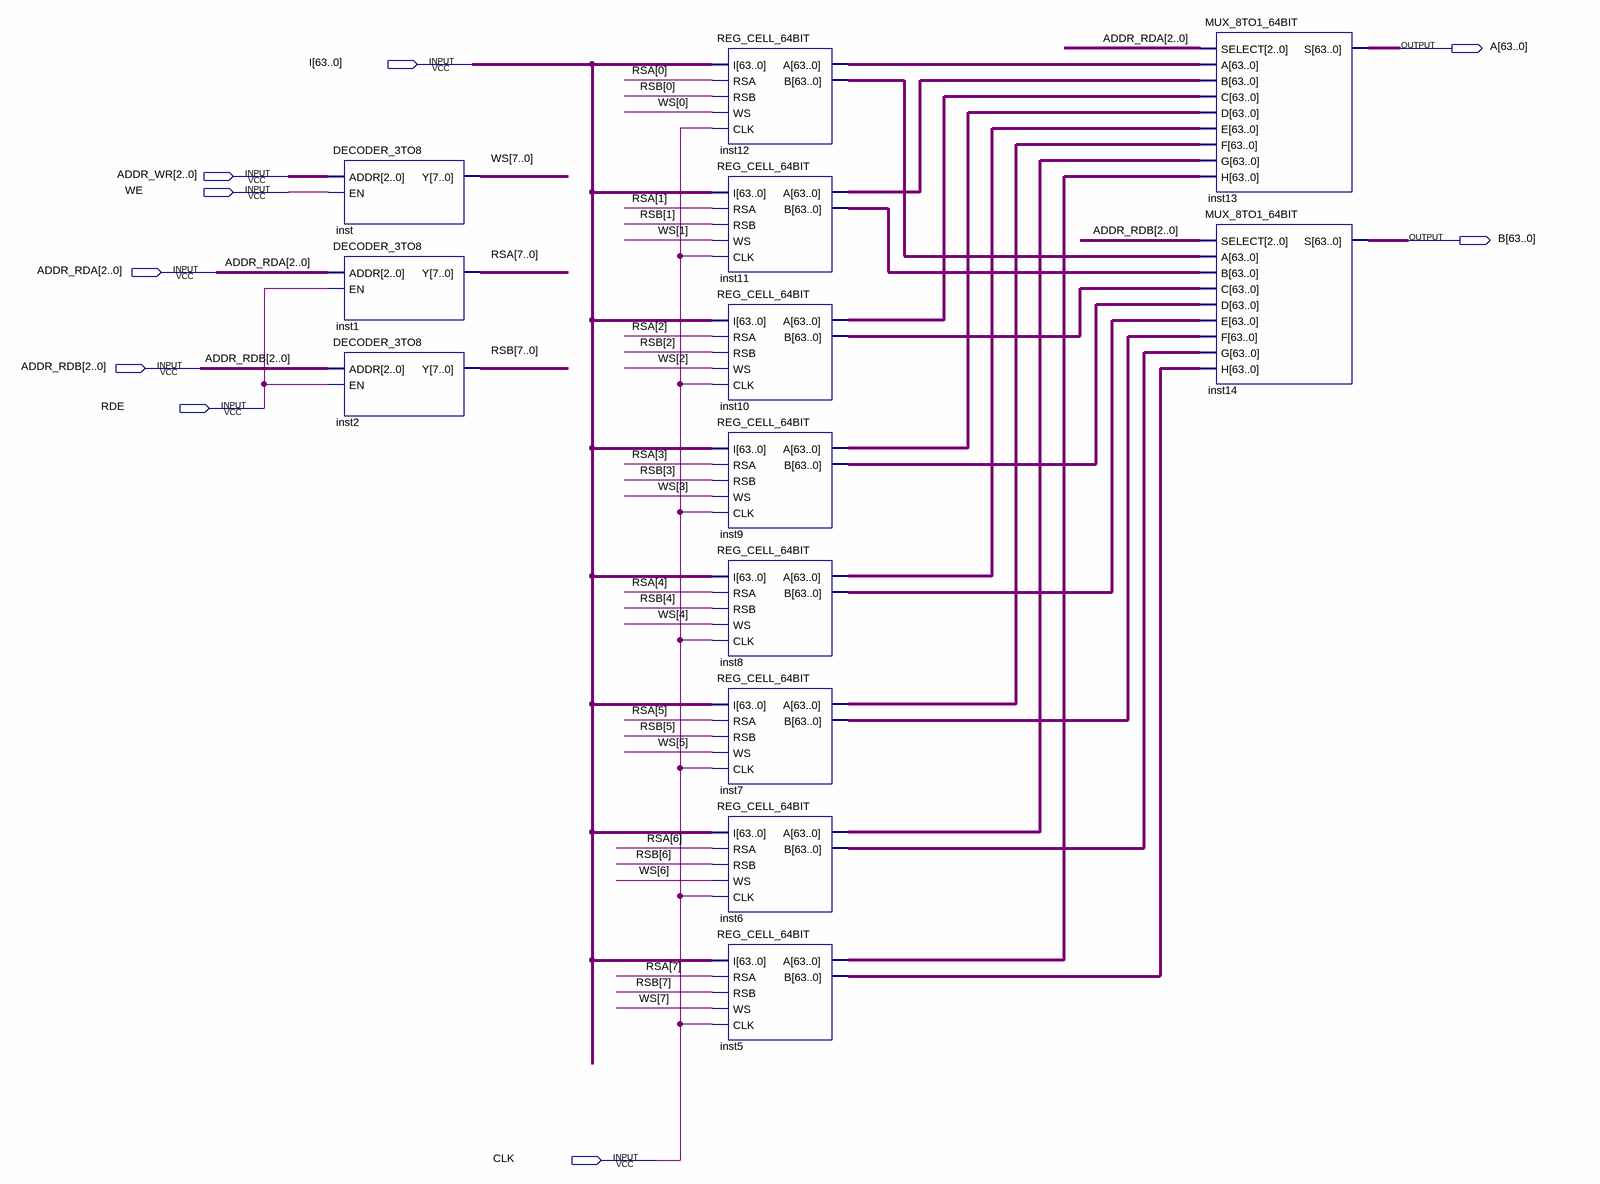
[diagram p0: schematic sheet]
// Quartus schematic REG_FILE_8_64BIT.bdf as structural Verilog: 13 symbols, 9 pins
module REG_FILE_8_64BIT (
  input  [63:0] I,
  input  [2:0] ADDR_WR,
  input  WE,
  input  [2:0] ADDR_RDA,
  input  [2:0] ADDR_RDB,
  input  RDE,
  input  CLK,
  output [63:0] A,
  output [63:0] B
);

  wire [7:0] RSA, RSB, WS;
  wire [63:0] inst5_a, inst5_b, inst6_a, inst6_b, inst7_a, inst7_b, inst8_a, inst8_b, inst9_a, inst9_b,
       inst10_a, inst10_b, inst11_a, inst11_b, inst12_a, inst12_b;

  DECODER_3TO8 inst (.ADDR(ADDR_WR), .EN(WE), .Y(WS));
  DECODER_3TO8 inst1 (.ADDR(ADDR_RDA), .EN(RDE), .Y(RSA));
  DECODER_3TO8 inst2 (.ADDR(ADDR_RDB), .EN(RDE), .Y(RSB));
  REG_CELL_64BIT inst12 (.I(I), .RSA(RSA[0]), .RSB(RSB[0]), .WS(WS[0]), .CLK(CLK), .A(inst12_a), .B(inst12_b));
  REG_CELL_64BIT inst11 (.I(I), .RSA(RSA[1]), .RSB(RSB[1]), .WS(WS[1]), .CLK(CLK), .A(inst11_a), .B(inst11_b));
  REG_CELL_64BIT inst10 (.I(I), .RSA(RSA[2]), .RSB(RSB[2]), .WS(WS[2]), .CLK(CLK), .A(inst10_a), .B(inst10_b));
  REG_CELL_64BIT inst9 (.I(I), .RSA(RSA[3]), .RSB(RSB[3]), .WS(WS[3]), .CLK(CLK), .A(inst9_a), .B(inst9_b));
  REG_CELL_64BIT inst8 (.I(I), .RSA(RSA[4]), .RSB(RSB[4]), .WS(WS[4]), .CLK(CLK), .A(inst8_a), .B(inst8_b));
  REG_CELL_64BIT inst7 (.I(I), .RSA(RSA[5]), .RSB(RSB[5]), .WS(WS[5]), .CLK(CLK), .A(inst7_a), .B(inst7_b));
  REG_CELL_64BIT inst6 (.I(I), .RSA(RSA[6]), .RSB(RSB[6]), .WS(WS[6]), .CLK(CLK), .A(inst6_a), .B(inst6_b));
  REG_CELL_64BIT inst5 (.I(I), .RSA(RSA[7]), .RSB(RSB[7]), .WS(WS[7]), .CLK(CLK), .A(inst5_a), .B(inst5_b));
  MUX_8TO1_64BIT inst13 (
    .SELECT(ADDR_RDA), .A(inst12_a), .B(inst11_a), .C(inst10_a), .D(inst9_a), .E(inst8_a), .F(inst7_a),
    .G(inst6_a), .H(inst5_a), .S(A));
  MUX_8TO1_64BIT inst14 (
    .SELECT(ADDR_RDB), .A(inst12_b), .B(inst11_b), .C(inst10_b), .D(inst9_b), .E(inst8_b), .F(inst7_b),
    .G(inst6_b), .H(inst5_b), .S(B));
endmodule
